# EAGLE design lattepanda_driverstation (EAGLE 7.6.0)
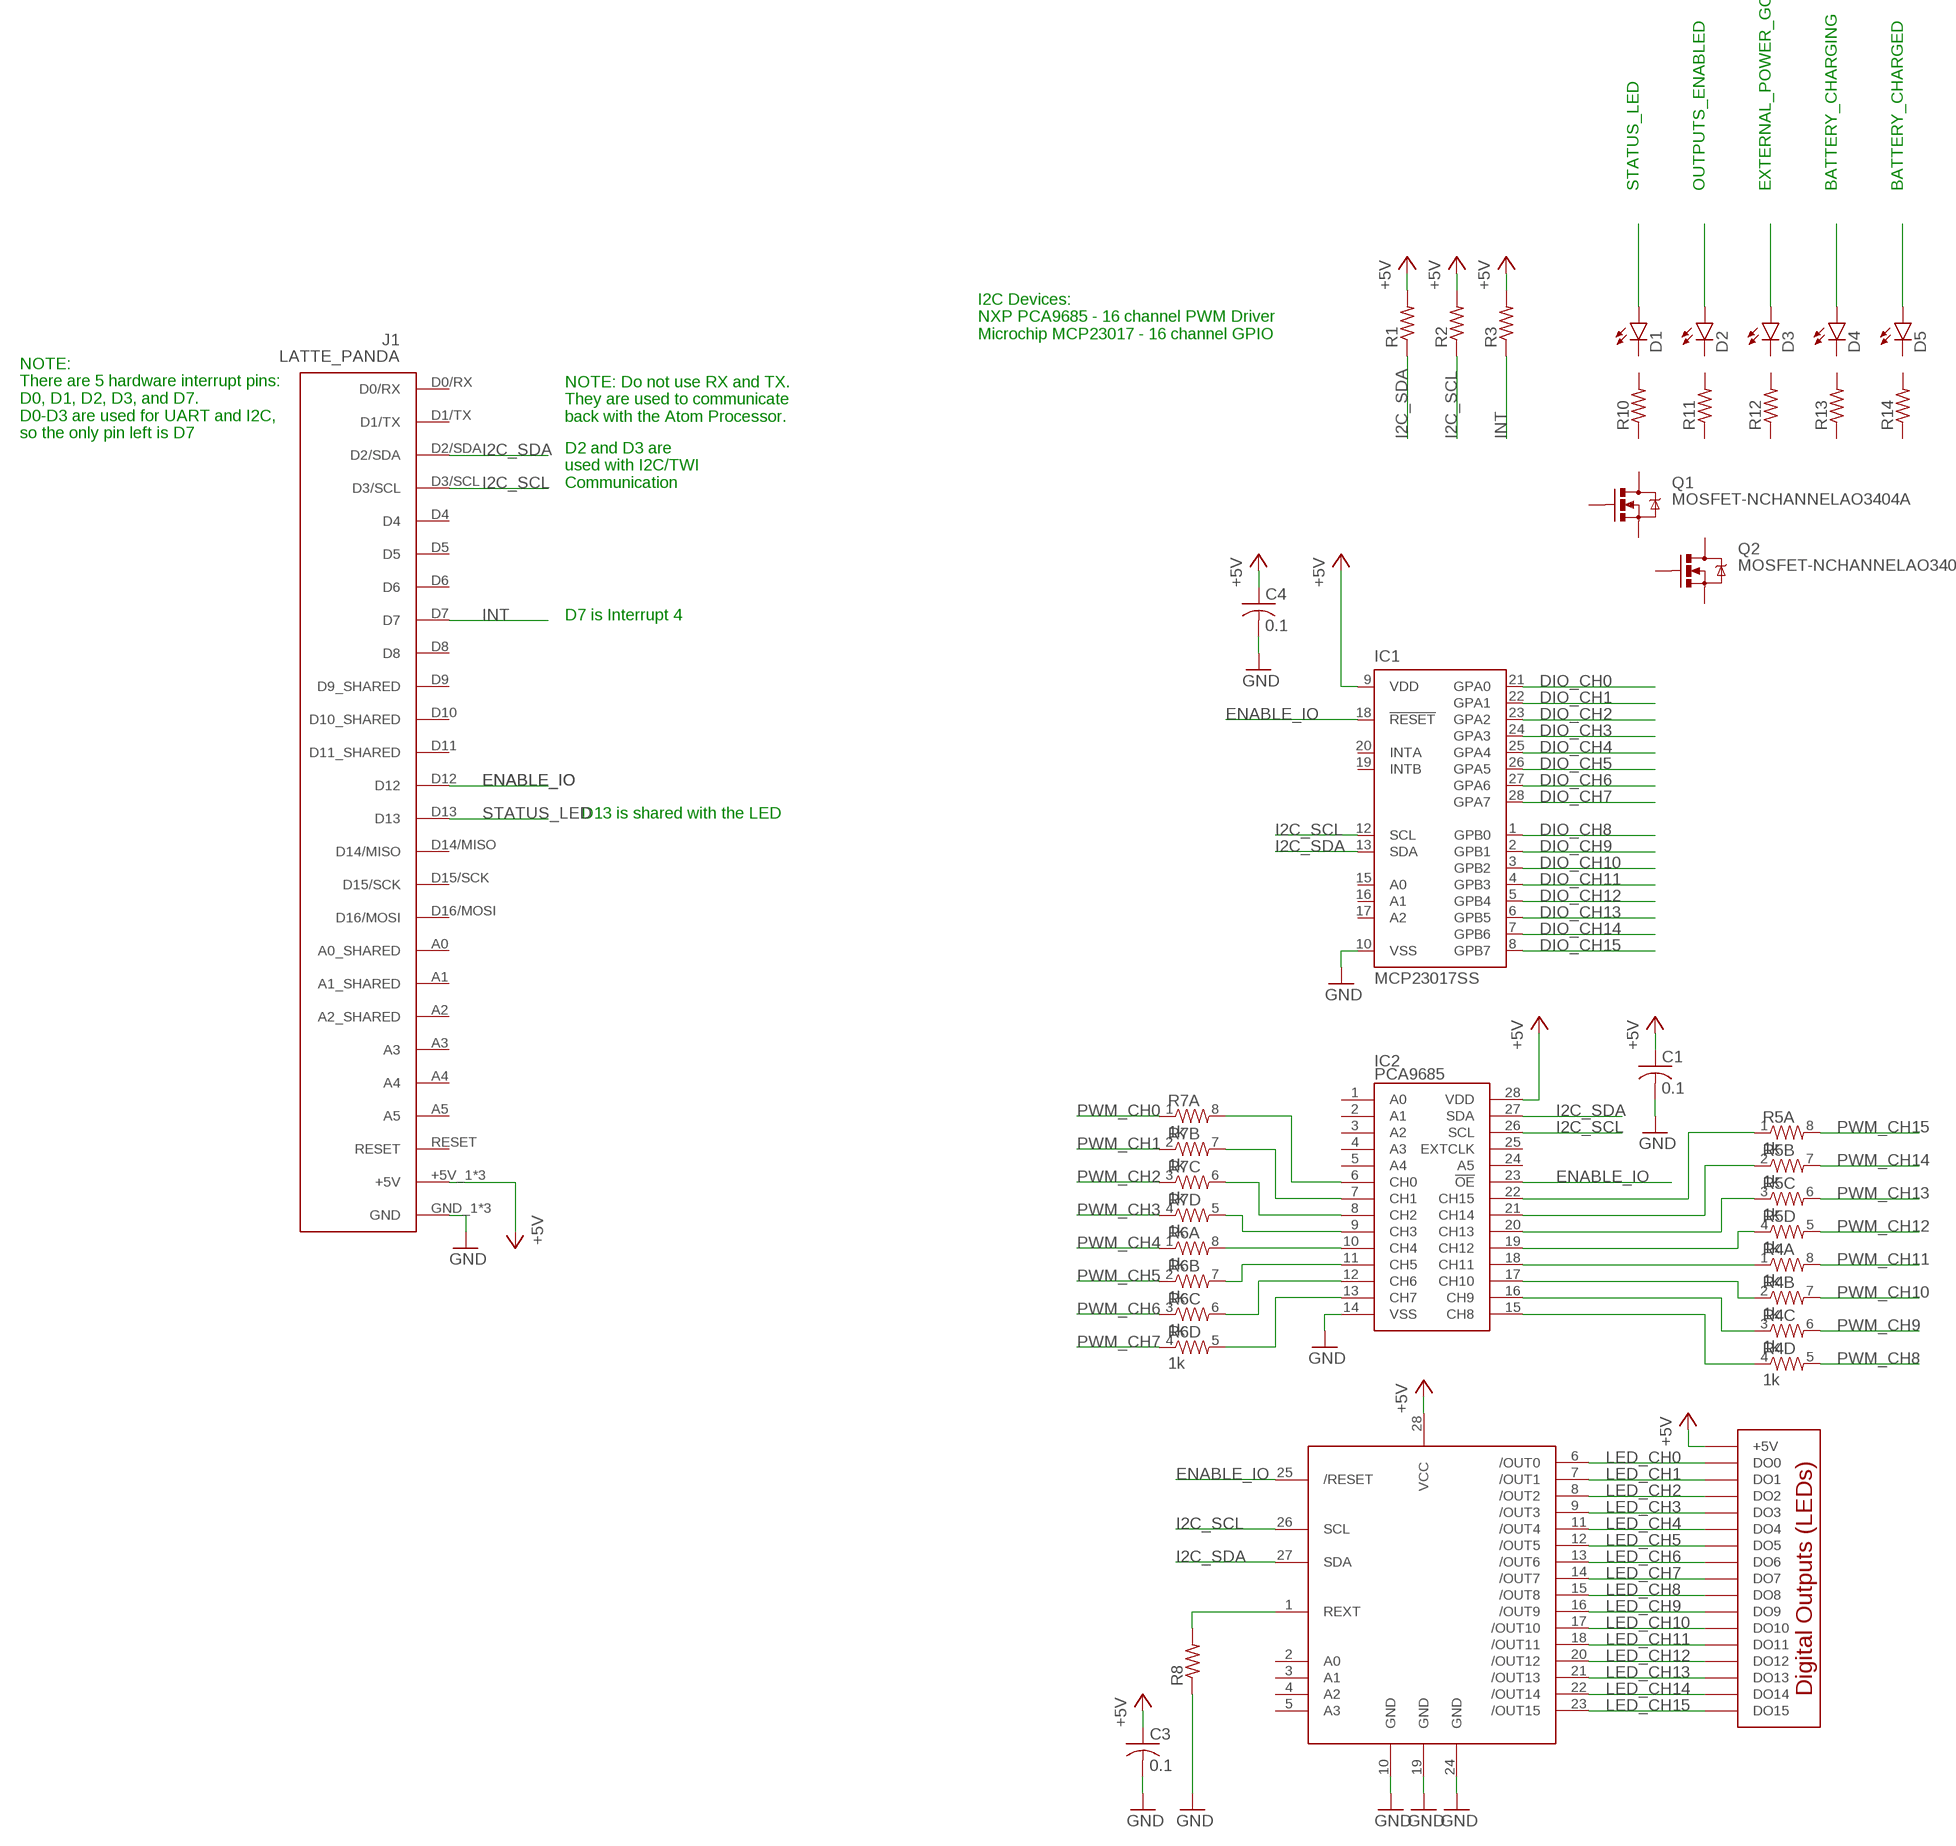
[diagram p0: schematic, sheet 1, part 1 of 2]
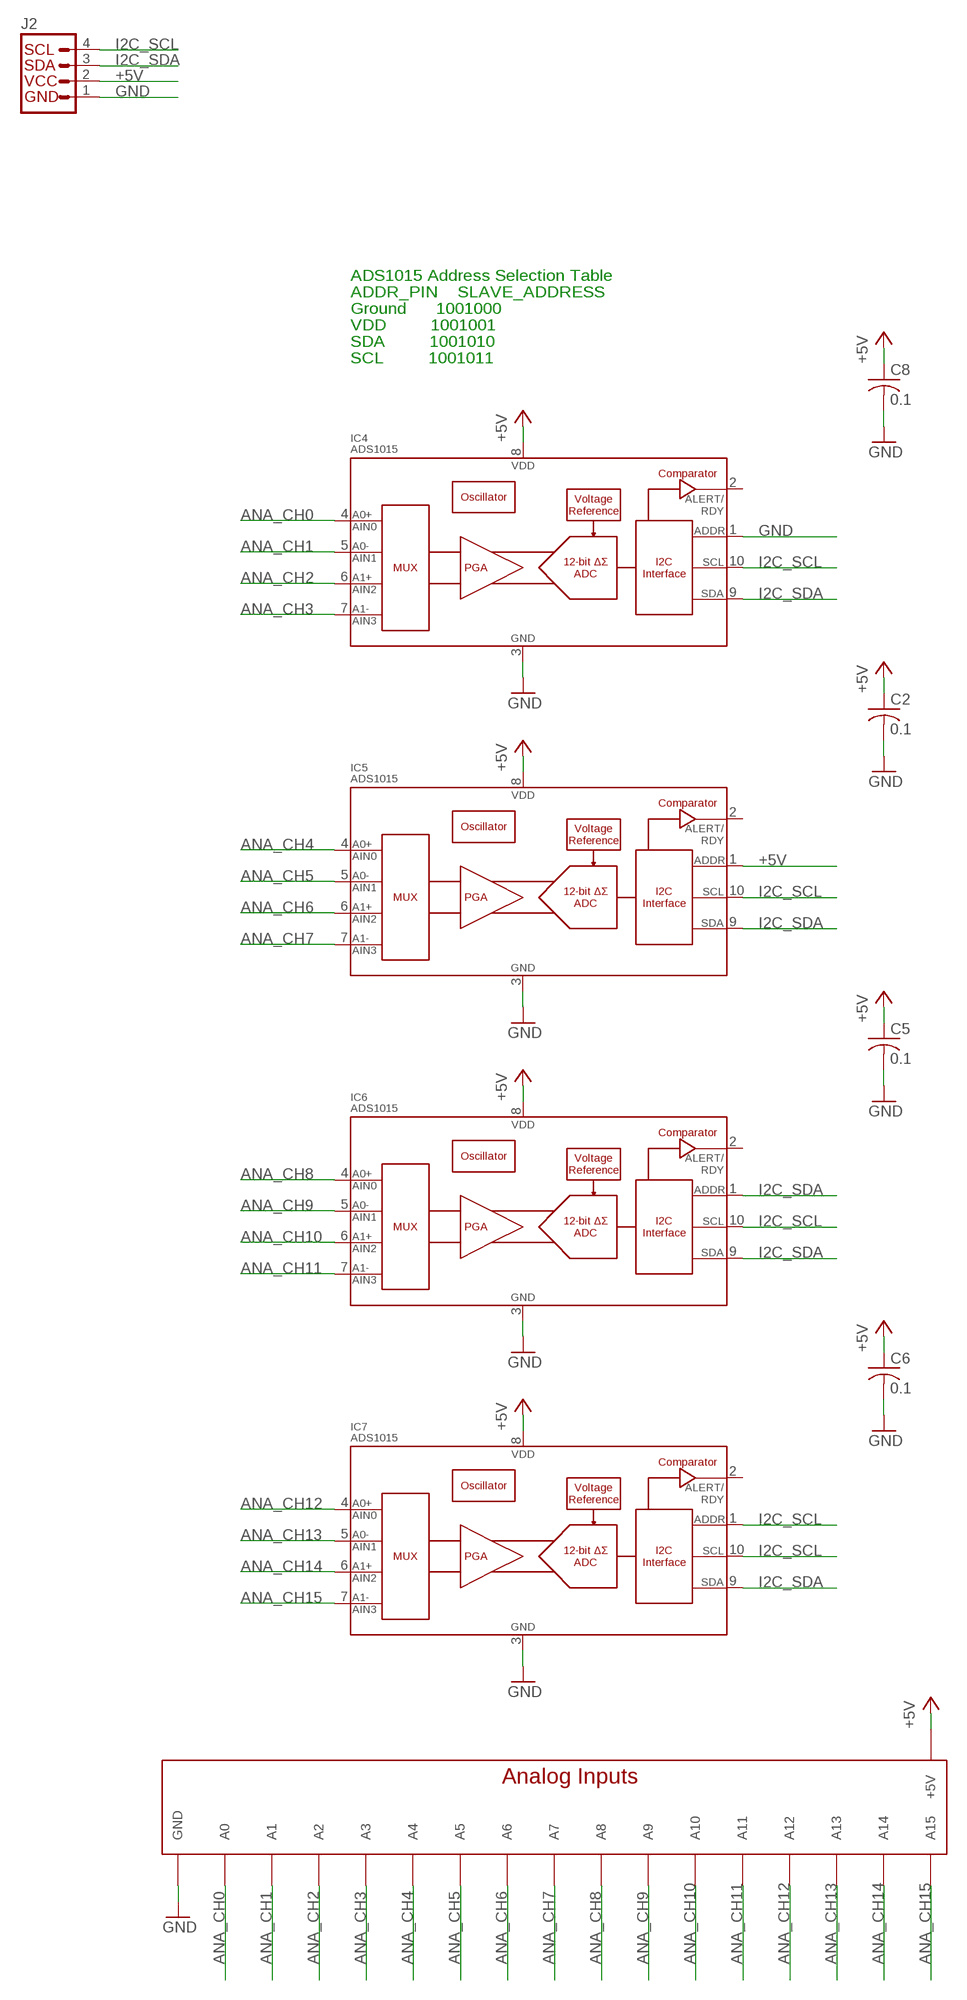
[diagram p1: schematic, sheet 1, part 2 of 2]

## Parts
C1  0.1  C-USC1206  [C1206]
C2  0.1  C-USC1206  [C1206]
C3  0.1  C-USC1206  [C1206]
C4  0.1  C-USC1206  [C1206]
C5  0.1  C-USC1206  [C1206]
C6  0.1  C-USC1206  [C1206]
C8  0.1  C-USC1206  [C1206]
D1  LED1206  [LED-1206]
D2  LED1206  [LED-1206]
D3  LED1206  [LED-1206]
D4  LED1206  [LED-1206]
D5  LED1206  [LED-1206]
IC1  MCP23017SS  [SSOP28]
IC2  PCA9685  [TSSOP-28_4MM]
IC3  TLC59116  [TSSOP28]
IC4  ADS1015  [MSOP10]
IC5  ADS1015  [MSOP10]
IC6  ADS1015  [MSOP10]
IC7  ADS1015  [MSOP10]
J1  LATTE_PANDA  [LATTE_PANDA]
J2  I2C_STANDARD  [1X04]
Q1  MOSFET-NCHANNELAO3404A  [SOT23-3]
Q2  MOSFET-NCHANNELAO3404A  [SOT23-3]
R1  R-US_M1206  [M1206]
R2  R-US_M1206  [M1206]
R3  R-US_M1206  [M1206]
R4  1k  RESISTOR-ARRAY0603-ARV  [0603-ARV]
R5  1k  RESISTOR-ARRAY0603-ARV  [0603-ARV]
R6  1k  RESISTOR-ARRAY0603-ARV  [0603-ARV]
R7  1k  RESISTOR-ARRAY0603-ARV  [0603-ARV]
R8  R-US_R1206  [R1206]
R10  R-US_M1206  [M1206]
R11  R-US_M1206  [M1206]
R12  R-US_M1206  [M1206]
R13  R-US_M1206  [M1206]
R14  R-US_M1206  [M1206]
U$1  ANALOGHEADER  [ANALOGHEADER]
U$2  DIGITALOUTPUTS  [DIGITALOUT]

## Nets
+5V: C1.1 C2.1 C3.1 C4.1 C5.1 C6.1 C8.1 IC1.9(VDD) IC2.28(VDD) IC3.28(VCC) IC4.8(VDD) IC5.1(ADDR) IC5.8(VDD) IC6.8(VDD) IC7.8(VDD) J1.+5V_1(+5V) J1.+5V_2(+5V) J1.+5V_3(+5V) J2.2 R1.2 R2.2 R3.2 U$1.+5V@0(+5V) U$1.+5V@1(+5V) U$1.+5V@2(+5V) U$1.+5V@3(+5V) U$1.+5V@4(+5V) U$1.+5V@5(+5V) U$1.+5V@6(+5V) U$1.+5V@7(+5V) U$1.+5V@8(+5V) U$1.+5V@9(+5V) U$1.+5V@10(+5V) U$1.+5V@11(+5V) U$1.+5V@12(+5V) U$1.+5V@13(+5V) U$1.+5V@14(+5V) U$1.+5V@15(+5V) U$2.+5V@0(+5V) U$2.+5V@1(+5V) U$2.+5V@2(+5V) U$2.+5V@3(+5V) U$2.+5V@4(+5V) U$2.+5V@5(+5V) U$2.+5V@6(+5V) U$2.+5V@7(+5V) U$2.+5V@8(+5V) U$2.+5V@9(+5V) U$2.+5V@10(+5V) U$2.+5V@11(+5V) U$2.+5V@12(+5V) U$2.+5V@13(+5V) U$2.+5V@14(+5V) U$2.+5V@15(+5V)
ANA_CH0: IC4.4(AIN0) U$1.0(A0)
ANA_CH1: IC4.5(AIN1) U$1.1(A1)
ANA_CH2: IC4.6(AIN2) U$1.2(A2)
ANA_CH3: IC4.7(AIN3) U$1.3(A3)
ANA_CH4: IC5.4(AIN0) U$1.4(A4)
ANA_CH5: IC5.5(AIN1) U$1.5(A5)
ANA_CH6: IC5.6(AIN2) U$1.6(A6)
ANA_CH7: IC5.7(AIN3) U$1.7(A7)
ANA_CH8: IC6.4(AIN0) U$1.8(A8)
ANA_CH9: IC6.5(AIN1) U$1.9(A9)
ANA_CH10: IC6.6(AIN2) U$1.10(A10)
ANA_CH11: IC6.7(AIN3) U$1.11(A11)
ANA_CH12: IC7.4(AIN0) U$1.12(A12)
ANA_CH13: IC7.5(AIN1) U$1.13(A13)
ANA_CH14: IC7.6(AIN2) U$1.14(A14)
ANA_CH15: IC7.7(AIN3) U$1.15(A15)
DIO_CH0: IC1.21(GPA0)
DIO_CH1: IC1.22(GPA1)
DIO_CH2: IC1.23(GPA2)
DIO_CH3: IC1.24(GPA3)
DIO_CH4: IC1.25(GPA4)
DIO_CH5: IC1.26(GPA5)
DIO_CH6: IC1.27(GPA6)
DIO_CH7: IC1.28(GPA7)
DIO_CH8: IC1.1(GPB0)
DIO_CH9: IC1.2(GPB1)
DIO_CH10: IC1.3(GPB2)
DIO_CH11: IC1.4(GPB3)
DIO_CH12: IC1.5(GPB4)
DIO_CH13: IC1.6(GPB5)
DIO_CH14: IC1.7(GPB6)
DIO_CH15: IC1.8(GPB7)
ENABLE_IO: IC1.18(!RESET) IC2.23(!OE) IC3.25(/RESET) J1.D12
GND: C1.2 C2.2 C3.2 C4.2 C5.2 C6.2 C8.2 IC1.10(VSS) IC2.14(VSS) IC3.10(GND) IC3.19(GND) IC3.24(GND) IC4.1(ADDR) IC4.3(VSS) IC5.3(VSS) IC6.3(VSS) IC7.3(VSS) J1.GND_1(GND) J1.GND_2(GND) J1.GND_3(GND) J2.1 R8.1 U$1.GND@0(GND) U$1.GND@1(GND) U$1.GND@2(GND) U$1.GND@3(GND) U$1.GND@4(GND) U$1.GND@5(GND) U$1.GND@6(GND) U$1.GND@7(GND) U$1.GND@8(GND) U$1.GND@9(GND) U$1.GND@10(GND) U$1.GND@11(GND) U$1.GND@12(GND) U$1.GND@13(GND) U$1.GND@14(GND) U$1.GND@15(GND)
I2C_SCL: IC1.12(SCL) IC2.26(SCL) IC3.26(SCL) IC4.10(SCL) IC5.10(SCL) IC6.10(SCL) IC7.1(ADDR) IC7.10(SCL) J1.D3/SCL J2.4 R2.1
I2C_SDA: IC1.13(SDA) IC2.27(SDA) IC3.27(SDA) IC4.9(SDA) IC5.9(SDA) IC6.1(ADDR) IC6.9(SDA) IC7.9(SDA) J1.D2/SDA J2.3 R1.1
INT: J1.D7 R3.1
LED_CH0: IC3.6(/OUT0) U$2.DO0
LED_CH1: IC3.7(/OUT1) U$2.DO1
LED_CH2: IC3.8(/OUT2) U$2.DO2
LED_CH3: IC3.9(/OUT3) U$2.DO3
LED_CH4: IC3.11(/OUT4) U$2.DO4
LED_CH5: IC3.12(/OUT5) U$2.DO5
LED_CH6: IC3.13(/OUT6) U$2.DO6
LED_CH7: IC3.14(/OUT7) U$2.DO7
LED_CH8: IC3.15(/OUT8) U$2.DO8
LED_CH9: IC3.16(/OUT9) U$2.DO9
LED_CH10: IC3.17(/OUT10) U$2.DO10
LED_CH11: IC3.18(/OUT11) U$2.DO11
LED_CH12: IC3.20(/OUT12) U$2.DO12
LED_CH13: IC3.21(/OUT13) U$2.DO13
LED_CH14: IC3.22(/OUT14) U$2.DO14
LED_CH15: IC3.23(/OUT15) U$2.DO15
N$1: IC2.6(CH0) R7.8
N$2: IC2.7(CH1) R7.7
N$3: IC2.8(CH2) R7.6
N$4: IC2.9(CH3) R7.5
N$5: IC2.10(CH4) R6.8
N$6: IC2.11(CH5) R6.7
N$7: IC2.12(CH6) R6.6
N$8: IC2.13(CH7) R6.5
N$9: IC2.15(CH8) R4.4
N$10: IC2.16(CH9) R4.3
N$11: IC2.17(CH10) R4.2
N$12: IC2.18(CH11) R4.1
N$13: IC2.19(CH12) R5.4
N$14: IC2.20(CH13) R5.3
N$15: IC2.21(CH14) R5.2
N$16: IC2.22(CH15) R5.1
N$17: IC3.1(REXT) R8.2
N$19: D1.A
N$20: D2.A
N$21: D3.A
N$22: D4.A
N$23: D5.A
PWM_CH0: R7.1
PWM_CH1: R7.2
PWM_CH2: R7.3
PWM_CH3: R7.4
PWM_CH4: R6.1
PWM_CH5: R6.2
PWM_CH6: R6.3
PWM_CH7: R6.4
PWM_CH8: R4.5
PWM_CH9: R4.6
PWM_CH10: R4.7
PWM_CH11: R4.8
PWM_CH12: R5.5
PWM_CH13: R5.6
PWM_CH14: R5.7
PWM_CH15: R5.8
STATUS_LED: J1.D13
Unconnected: D1.C D2.C D3.C D4.C D5.C IC1.15(A0) IC1.16(A1) IC1.17(A2) IC1.19(INTB) IC1.20(INTA) IC2.1(A0) IC2.2(A1) IC2.3(A2) IC2.4(A3) IC2.5(A4) IC2.24(A5) IC2.25(EXTCLK) IC3.2(A0) IC3.3(A1) IC3.4(A2) IC3.5(A3) IC4.2(ALERT/RDY) IC5.2(ALERT/RDY) IC6.2(ALERT/RDY) IC7.2(ALERT/RDY) J1.A0(A0_SHARED) J1.A1(A1_SHARED) J1.A2(A2_SHARED) J1.A3 J1.A4 J1.A5 J1.D0/RX J1.D1/TX J1.D4 J1.D5 J1.D6 J1.D8 J1.D9(D9_SHARED) J1.D10(D10_SHARED) J1.D11(D11_SHARED) J1.D14/MISO J1.D15/SCK J1.D16/MOSI J1.RESET Q1.1(G) Q1.2(S) Q1.3(D) Q2.1(G) Q2.2(S) Q2.3(D) R10.1 R10.2 R11.1 R11.2 R12.1 R12.2 R13.1 R13.2 R14.1 R14.2

## Notes on the sheet
- STATUS_LED | OUTPUTS_ENABLED | EXTERNAL_POWER_GOOD | BATTERY_CHARGING | BATTERY_CHARGED
- I2C Devices:
  NXP PCA9685 - 16 channel PWM Driver
  Microchip MCP23017 - 16 channel GPIO
- NOTE: Do not use RX and TX. 
  They are used to communicate 
  back with the Atom Processor.
- NOTE:
  There are 5 hardware interrupt pins: 
  D0, D1, D2, D3, and D7.
  D0-D3 are used for UART and I2C, 
  so the only pin left is D7
- D2 and D3 are
  used with I2C/TWI
  Communication
- ADS1015 Address Selection Table
  ADDR_PIN    SLAVE_ADDRESS
  Ground      1001000
  VDD         1001001
  SDA         1001010
  SCL         1001011
- D7 is Interrupt 4
- D13 is shared with the LED

## Library data of the parts
C1-C6 C8 = rcl:C-US: CAPACITOR, American symbol
D1-D5 = SparkFun-LED:LED: LEDs Standard schematic elements and footprints for 5mm, 3mm, 1206, and 0603 sized LEDs. 5mm - Spark Fun Electronics SKU : COM-00529 (and others)
IC1 = microchip:MCP23017: http://ww1.microchip.com/downloads/en/DeviceDoc/21952a.pdf Source: http://ww1.microchip.com/downloads/en/DeviceDoc/21952a.pdf; MF: MICROCHIP; MPN: MCP23017-E/SS; OC_FARNELL: 1467674; OC_NEWARK: 31K2960
IC2 = SparkFun-DigitalIC:PCA9685: 16-channel 12-bit PWM I2C interface Internal Oscillator 40Hz to 1kHz Can be totem pole or open collector 2.3V to 5.5V; PROD_ID: IC-12240
IC3 = TI_TLC59116:TLC59116
IC4-IC7 = SparkFun-AnalogIC:ADS1015: 12-Bit Del-Sig ADC Four single-ended inputs or two differential inputs Internal PGA I2C interface 2.0-5.5V; PROD_ID: IC-12239
J1 = LattePanda:LATTE_PANDA
J2 = SparkFun-Connectors:I2C_STANDARD: SparkFun has standardized on a pinout for all I2C based sensor breakouts. This pinout allows I2C boards to be plugged directly into the headers on Arduino Uno compatible boards, and to be daisy chained easily.
Q1 Q2 = SparkFun-DiscreteSemi:MOSFET-NCHANNEL: Common NMOSFET Parts MFG P/N Store ID Prod ID FDD8780 TRANS-09984 SI7820DN TRANS-11055 FDS6630A IC-08089 2N7002PW TRANS-11151 FQP30N06L COM-10213 TRANS-10060 BSS123LT1G TRANS-08345 BSS138 TRANS-00830 BS170 2N7000; PROD_ID: TRAN-12988
R1-R3 R8 R10-R14 = rcl:R-US_: RESISTOR, American symbol
R4-R7 = SparkFun-Resistors:RESISTOR-ARRAY: Array Chip Resistor Source: RS Component / Phycomp
U$1 = ControlBoard:ANALOGHEADER
U$2 = ControlBoard:DIGITALOUTPUTS

## Board
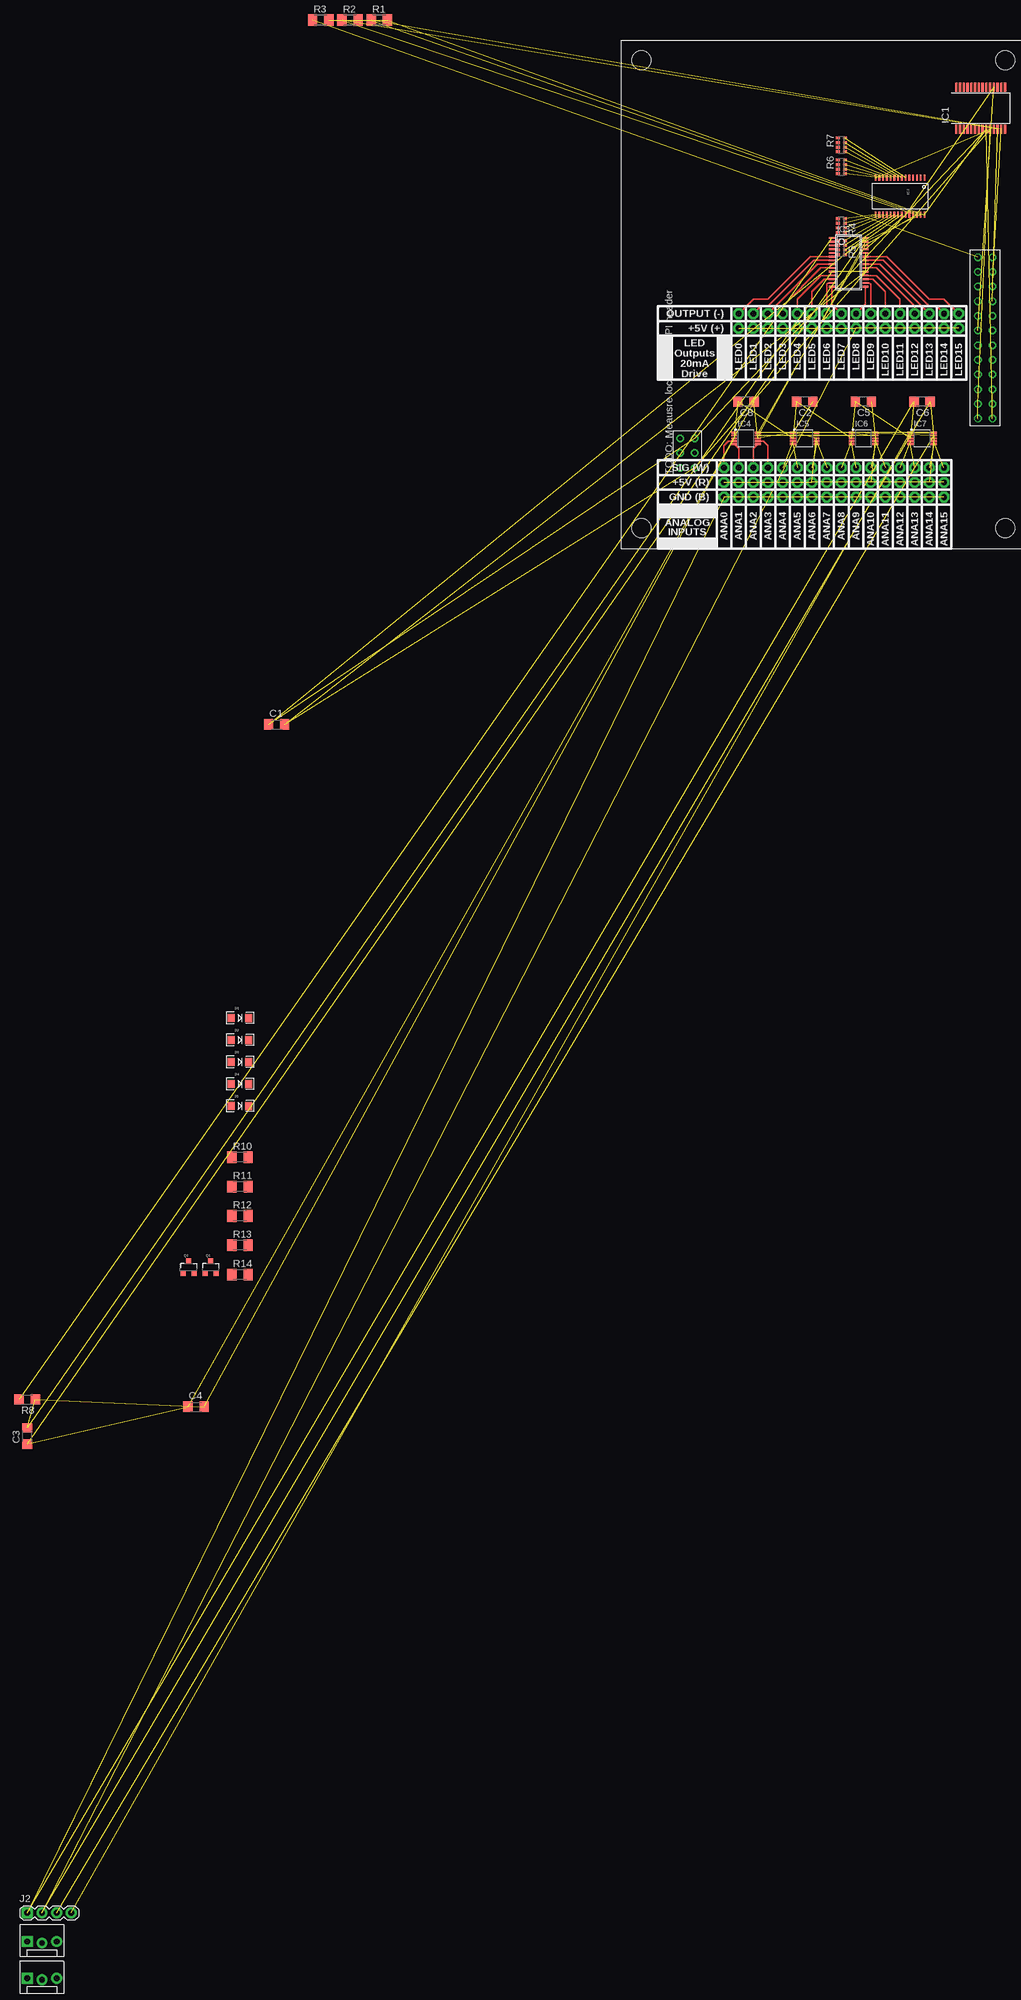
[diagram p2: board, top side]

No outline drawn. Coordinates in mm, seen from the top.
Copper layers (1*16): Top 0.035mm / dielectric 1.5mm / Bottom 0.035mm
Design rules "default": minimum track width 10mil, minimum drill 24mil, track to track 8mil, track to pad 8mil, pad to pad 8mil, via to via 8mil, smd to smd 8mil, copper to edge 40mil, drill to drill 8mil, minimum pad ring 10mil, minimum via ring 8mil, stop-mask expansion 4mil, vias tented up to drill 0mil, thermal gap 10mil

### Footprints (pad centres in the part's own frame; a part is rotated, then mirrored left to right if it is on the bottom)
C1206 = smd 1.6 x 1.8: 1 -1.4,0; 2 1.4,0
LED-1206 = smd 1.2 x 1.4: A -1.5,0; C 1.5,0
SSOP28 = smd 0.4 x 1.5: 1 -4.225,-3.625; 2 -3.575,-3.625; 3 -2.925,-3.625; 4 -2.275,-3.625; 5 -1.625,-3.625; 6 -0.975,-3.625; 7 -0.325,-3.625; 8 0.325,-3.625; 9 0.975,-3.625; 10 1.625,-3.625; 11 2.275,-3.625; 12 2.925,-3.625; 13 3.575,-3.625; 14 4.225,-3.625; 15 4.225,3.625; 16 3.575,3.625; 17 2.925,3.625; 18 2.275,3.625; 19 1.625,3.625; 20 0.975,3.625; 21 0.325,3.625; 22 -0.325,3.625; 23 -0.975,3.625; 24 -1.625,3.625; 25 -2.275,3.625; 26 -2.925,3.625; 27 -3.575,3.625; 28 -4.225,3.625
TSSOP-28_4MM = smd 1 x 0.3: 1 -3.2,4.225; 2 -3.2,3.575; 3 -3.2,2.925; 4 -3.2,2.275; 5 -3.2,1.625; 6 -3.2,0.975; 7 -3.2,0.325; 8 -3.2,-0.325; 9 -3.2,-0.975; 10 -3.2,-1.625; 11 -3.2,-2.275; 12 -3.2,-2.925; 13 -3.2,-3.575; 14 -3.2,-4.225; 15 3.2,-4.225; 16 3.2,-3.575; 17 3.2,-2.925; 18 3.2,-2.275; 19 3.2,-1.625; 20 3.2,-0.975; 21 3.2,-0.325; 22 3.2,0.325; 23 3.2,0.975; 24 3.2,1.625; 25 3.2,2.275; 26 3.2,2.925; 27 3.2,3.575; 28 3.2,4.225
TSSOP28 = smd 0.305 x 0.991: 1 -4.225,-2.918; 2 -3.575,-2.918; 3 -2.925,-2.918; 4 -2.275,-2.918; 5 -1.625,-2.918; 6 -0.975,-2.918; 7 -0.325,-2.918; 8 0.325,-2.918; 9 0.975,-2.918; 10 1.625,-2.918; 11 2.275,-2.918; 12 2.925,-2.918; 13 3.575,-2.918; 14 4.225,-2.918; 15 4.225,2.918; 16 3.575,2.918; 17 2.925,2.918; 18 2.275,2.918; 19 1.625,2.918; 20 0.975,2.918; 21 0.325,2.918; 22 -0.325,2.918; 23 -0.975,2.918; 24 -1.625,2.918; 25 -2.275,2.918; 26 -2.925,2.918; 27 -3.575,2.918; 28 -4.225,2.918
MSOP10 = smd 0.3 x 1: 1 -1,-2.05; 2 -0.5,-2.05; 3 0,-2.05; 4 0.5,-2.05; 5 1,-2.05; 6 1,2.05; 7 0.5,2.05; 8 0,2.05; 9 -0.5,2.05; 10 -1,2.05
LATTE_PANDA = drill 0.8: +5V_1 64.27,25.01; +5V_2 64.27,22.47; +5V_3 12.7,19.05; A0 64.27,32.63; A1 64.27,30.09; A2 64.27,27.55; A3 61.73,32.63; A4 61.73,30.09; A5 61.73,27.55; D0/RX 64.27,50.41; D1/TX 64.27,47.87; D2/SDA 64.27,45.33; D3/SCL 64.27,42.79; D4 64.27,40.25; D5 64.27,37.71; D6 64.27,35.17; D7 61.73,50.41; D8 61.73,47.87; D9 61.73,45.33; D10 61.73,42.79; D11 61.73,40.25; D12 61.73,37.71; D13 61.73,35.17; D14/MISO 10.16,19.05; D15/SCK 10.16,16.51; D16/MOSI 12.7,16.51; GND_1 61.73,25.01; GND_2 61.73,22.47; GND_3 12.7,13.97; RESET 10.16,13.97 | hole 3.3: 66.5,84.5; 3.5,3.5; 66.5,3.5; 3.5,84.5
1X04 = drill 1.016 pad 1.88 square: 1 0,0 | drill 1.016 pad 1.88: 2 2.54,0; 3 5.08,0; 4 7.62,0
MOLEX-1X3_LOCK = drill 1.016 pad 1.88 square: 1 0,0.127 | drill 1.016 pad 1.88: 2 2.54,-0.127; 3 5.08,0.127
SOT23-3 = smd 0.8 x 0.9: 1 -0.95,-1; 2 0.95,-1; 3 0,1.1
M1206 = smd 1.6 x 2: 1 -1.4,0; 2 1.4,0
0603-ARV = smd 0.5 x 0.65: 1 -1.2,-0.625; 2 -0.4,-0.625; 3 0.4,-0.625; 4 1.2,-0.625; 5 1.2,0.625; 6 0.4,0.625; 7 -0.4,0.625; 8 -1.2,0.625
R1206 = smd 1.6 x 1.803: 1 -1.422,0; 2 1.422,0
ANALOGHEADER = drill 1.016 pad 1.88 octagon: 0 1.27,11.43; 1 1.27,13.97; 2 1.27,16.51; 3 1.27,19.05; 4 1.27,21.59; 5 1.27,24.13; 6 1.27,26.67; 7 1.27,29.21; 8 1.27,31.75; 9 1.27,34.29; 10 1.27,36.83; 11 1.27,39.37; 12 1.27,41.91; 13 1.27,44.45; 14 1.27,46.99; 15 1.27,49.53; +5V@0 3.81,11.43; +5V@1 3.81,13.97; +5V@2 3.81,16.51; +5V@3 3.81,19.05; +5V@4 3.81,21.59; +5V@5 3.81,24.13; +5V@6 3.81,26.67; +5V@7 3.81,29.21; +5V@8 3.81,31.75; +5V@9 3.81,34.29; +5V@10 3.81,36.83; +5V@11 3.81,39.37; +5V@12 3.81,41.91; +5V@13 3.81,44.45; +5V@14 3.81,46.99; +5V@15 3.81,49.53; GND@0 6.35,11.43; GND@1 6.35,13.97; GND@2 6.35,16.51; GND@3 6.35,19.05; GND@4 6.35,21.59; GND@5 6.35,24.13; GND@6 6.35,26.67; GND@7 6.35,29.21; GND@8 6.35,31.75; GND@9 6.35,34.29; GND@10 6.35,36.83; GND@11 6.35,39.37; GND@12 6.35,41.91; GND@13 6.35,44.45; GND@14 6.35,46.99; GND@15 6.35,49.53
DIGITALOUT = drill 1.016 pad 1.88 octagon: +5V@0 -15.24,-1.27; +5V@1 -12.7,-1.27; +5V@2 -10.16,-1.27; +5V@3 -7.62,-1.27; +5V@4 -5.08,-1.27; +5V@5 -2.54,-1.27; +5V@6 0,-1.27; +5V@7 2.54,-1.27; +5V@8 5.08,-1.27; +5V@9 7.62,-1.27; +5V@10 10.16,-1.27; +5V@11 12.7,-1.27; +5V@12 15.24,-1.27; +5V@13 17.78,-1.27; +5V@14 20.32,-1.27; +5V@15 22.86,-1.27; DO0 -15.24,1.27; DO1 -12.7,1.27; DO2 -10.16,1.27; DO3 -7.62,1.27; DO4 -5.08,1.27; DO5 -2.54,1.27; DO6 0,1.27; DO7 2.54,1.27; DO8 5.08,1.27; DO9 7.62,1.27; DO10 10.16,1.27; DO11 12.7,1.27; DO12 15.24,1.27; DO13 17.78,1.27; DO14 20.32,1.27; DO15 22.86,1.27

### Placement (x,y rotation side)
C1  -59.69,-30.48 0 top
C2  31.75,25.4 180 top
C3  -102.87,-153.67 90 top
C4  -73.66,-148.59 0 top
C5  41.91,25.4 180 top
C6  52.07,25.4 180 top
C8  21.59,25.4 180 top
D1  -66.04,-81.28 0 top
D2  -66.04,-85.09 0 top
D3  -66.04,-88.9 0 top
D4  -66.04,-92.71 0 top
D5  -66.04,-96.52 0 top
IC1  62.23,76.2 0 top
IC2  48.26,60.96 270 top
IC3  39.37,49.53 270 top
IC4  21.59,19.05 270 top
IC5  31.75,19.05 270 top
IC6  41.91,19.05 270 top
IC7  52.07,19.05 270 top
J1  0,0 0 top
J2  -102.87,-236.22 0 top
J3  TEMP_SENSE  [MOLEX-1X3_LOCK]  -102.87,-241.3 0 top
J4  FAN_OUT  [MOLEX-1X3_LOCK]  -102.87,-247.65 0 top
Q1  -71.12,-124.46 0 top
Q2  -74.93,-124.46 0 top
R1  -41.91,91.44 0 top
R2  -46.99,91.44 0 top
R3  -52.07,91.44 0 top
R4  38.1,55.88 90 top
R5  38.1,52.07 90 top
R6  38.1,66.04 270 top
R7  38.1,69.85 270 top
R8  -102.87,-147.32 180 top
R10  -66.04,-105.41 0 top
R11  -66.04,-110.49 0 top
R12  -66.04,-115.57 0 top
R13  -66.04,-120.65 0 top
R14  -66.04,-125.73 0 top
U$1  6.35,15.24 270 top
U$2  35.56,39.37 0 top

### Tracks (layer width: path | path; a pad name or v marks a point on that pad's centre or on a via)
+5V  (53 unrouted)
ANA_CH0
  Top 0.254: IC4.4 18.55,18.55 17.78,17.78 U$1.0
ANA_CH1
  Top 0.254: IC4.5 20.32,17.27 U$1.1
ANA_CH2
  Top 0.254: IC4.6 22.86,17.27 U$1.2
ANA_CH3
  Top 0.254: IC4.7 24.63,18.55 25.4,17.78 U$1.3
ANA_CH4  (1 unrouted)
ANA_CH5  (1 unrouted)
ANA_CH6  (1 unrouted)
ANA_CH7  (1 unrouted)
ANA_CH8  (1 unrouted)
ANA_CH9  (1 unrouted)
ANA_CH10  (1 unrouted)
ANA_CH11  (1 unrouted)
ANA_CH12  (1 unrouted)
ANA_CH13  (1 unrouted)
ANA_CH14  (1 unrouted)
ANA_CH15  (1 unrouted)
ENABLE_IO  (3 unrouted)
GND  (37 unrouted)
I2C_SCL  (10 unrouted)
I2C_SDA  (10 unrouted)
INT  (1 unrouted)
LED_CH0
  Top 0.254: IC3.6 32.73,50.51 25.4,43.18 22.86,43.18 U$2.DO0
LED_CH1
  Top 0.254: IC3.7 33.34,49.85 25.4,41.91 24.13,41.91 U$2.DO1
LED_CH2
  Top 0.254: IC3.8 33.97,49.2 U$2.DO2
LED_CH3
  Top 0.254: IC3.9 34.59,48.55 27.94,41.91 U$2.DO3
LED_CH4
  Top 0.254: IC3.11 34.55,47.26 30.48,43.18 U$2.DO4
LED_CH5
  Top 0.254: IC3.12 35.17,46.6 33.02,44.45 U$2.DO5
LED_CH6
  Top 0.254: IC3.13 35.8,45.95 35.56,45.72 U$2.DO6
LED_CH7
  Top 0.254: IC3.14 36.45,42.29 U$2.DO7
LED_CH8
  Top 0.254: IC3.15 42.29,42.29 U$2.DO8
LED_CH9
  Top 0.254: IC3.16 42.95,45.95 43.18,45.72 U$2.DO9
LED_CH10
  Top 0.254: IC3.17 43.56,46.6 45.72,44.45 U$2.DO10
LED_CH11
  Top 0.254: IC3.18 44.19,47.26 48.26,43.18 U$2.DO11
LED_CH12
  Top 0.254: IC3.20 44.16,48.55 50.8,41.91 U$2.DO12
LED_CH13
  Top 0.254: IC3.21 44.77,49.2 U$2.DO13
LED_CH14
  Top 0.254: IC3.22 45.4,49.85 53.34,41.91 54.61,41.91 U$2.DO14
LED_CH15
  Top 0.254: IC3.23 46.02,50.51 53.34,43.18 55.88,43.18 U$2.DO15
N$1  (1 unrouted)
N$2  (1 unrouted)
N$3  (1 unrouted)
N$4  (1 unrouted)
N$5  (1 unrouted)
N$6  (1 unrouted)
N$7  (1 unrouted)
N$8  (1 unrouted)
N$9  (1 unrouted)
N$10  (1 unrouted)
N$11  (1 unrouted)
N$12  (1 unrouted)
N$13  (1 unrouted)
N$14  (1 unrouted)
N$15  (1 unrouted)
N$16  (1 unrouted)
N$17  (1 unrouted)